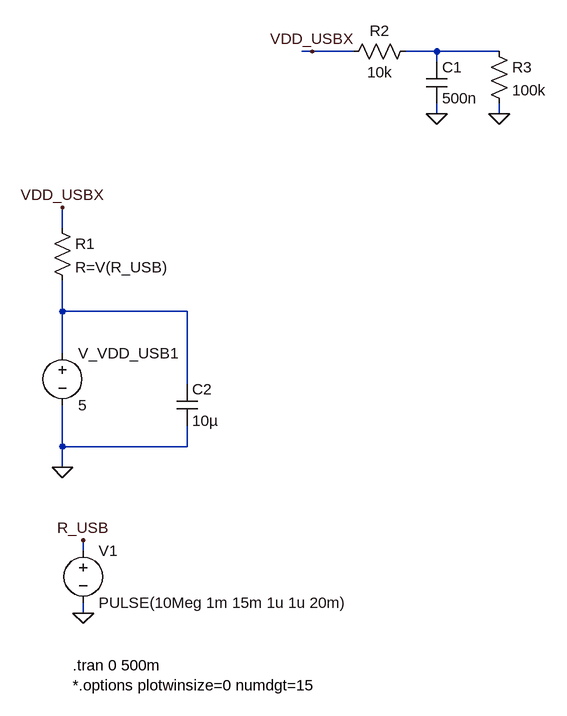
[diagram p0: schematic Draft1.asc]
Draft1.asc, the LTspice schematic file:
Version 4
SHEET 1 880 884
WIRE 256 -96 240 -96
WIRE 320 -96 256 -96
WIRE 448 -96 400 -96
WIRE 544 -96 448 -96
WIRE 448 -80 448 -96
WIRE 448 0 448 -16
WIRE 544 0 544 -16
WIRE -128 176 -128 144
WIRE -128 304 -128 256
WIRE 64 304 -128 304
WIRE -128 368 -128 304
WIRE 64 416 64 304
WIRE -128 512 -128 448
WIRE 64 512 64 480
WIRE 64 512 -128 512
WIRE -128 544 -128 512
WIRE -96 672 -96 656
WIRE -96 768 -96 752
FLAG -128 544 0
FLAG -128 144 VDD_USBX
FLAG -96 768 0
FLAG -96 656 R_USB
FLAG 448 0 0
FLAG 256 -96 VDD_USBX
FLAG 544 0 0
SYMBOL res -144 160 R0
SYMATTR InstName R1
SYMATTR Value R=V(R_USB)
SYMBOL voltage -128 352 R0
SYMATTR InstName V_VDD_USB1
SYMATTR Value 5
SYMBOL voltage -96 656 R0
SYMATTR InstName V1
SYMATTR Value PULSE(10Meg 1m 15m 1u 1u 20m)
SYMBOL cap 432 -80 R0
SYMATTR InstName C1
SYMATTR Value 500n
SYMBOL cap 48 416 R0
SYMATTR InstName C2
SYMATTR Value 10µ
SYMBOL res 528 -112 R0
SYMATTR InstName R3
SYMATTR Value 100k
SYMBOL res 416 -112 R90
WINDOW 0 0 56 VBottom 2
WINDOW 3 32 56 VTop 2
SYMATTR InstName R2
SYMATTR Value 10k
TEXT -112 848 Left 2 !.tran 0 500m\n*.options plotwinsize=0 numdgt=15

The netlist it stands for:
* Draft1.asc
R1 VDD_USBX N002 R=V(R_USB)
V_VDD_USB1 N002 0 5
V1 R_USB 0 PULSE(10Meg 1m 15m 1u 1u 20m)
C1 N001 0 500n
C2 N002 0 10µ
R3 N001 0 100k
R2 N001 VDD_USBX 10k
.tran 0 500m
*.options plotwinsize=0 numdgt=15
.backanno
.end